# Altium schematic sheet deserializer.SchDoc: SERIALIZER
size 431 x 279 mm; SheetNumber: 3; SheetTotal: 3; SheetRevision: 1.0
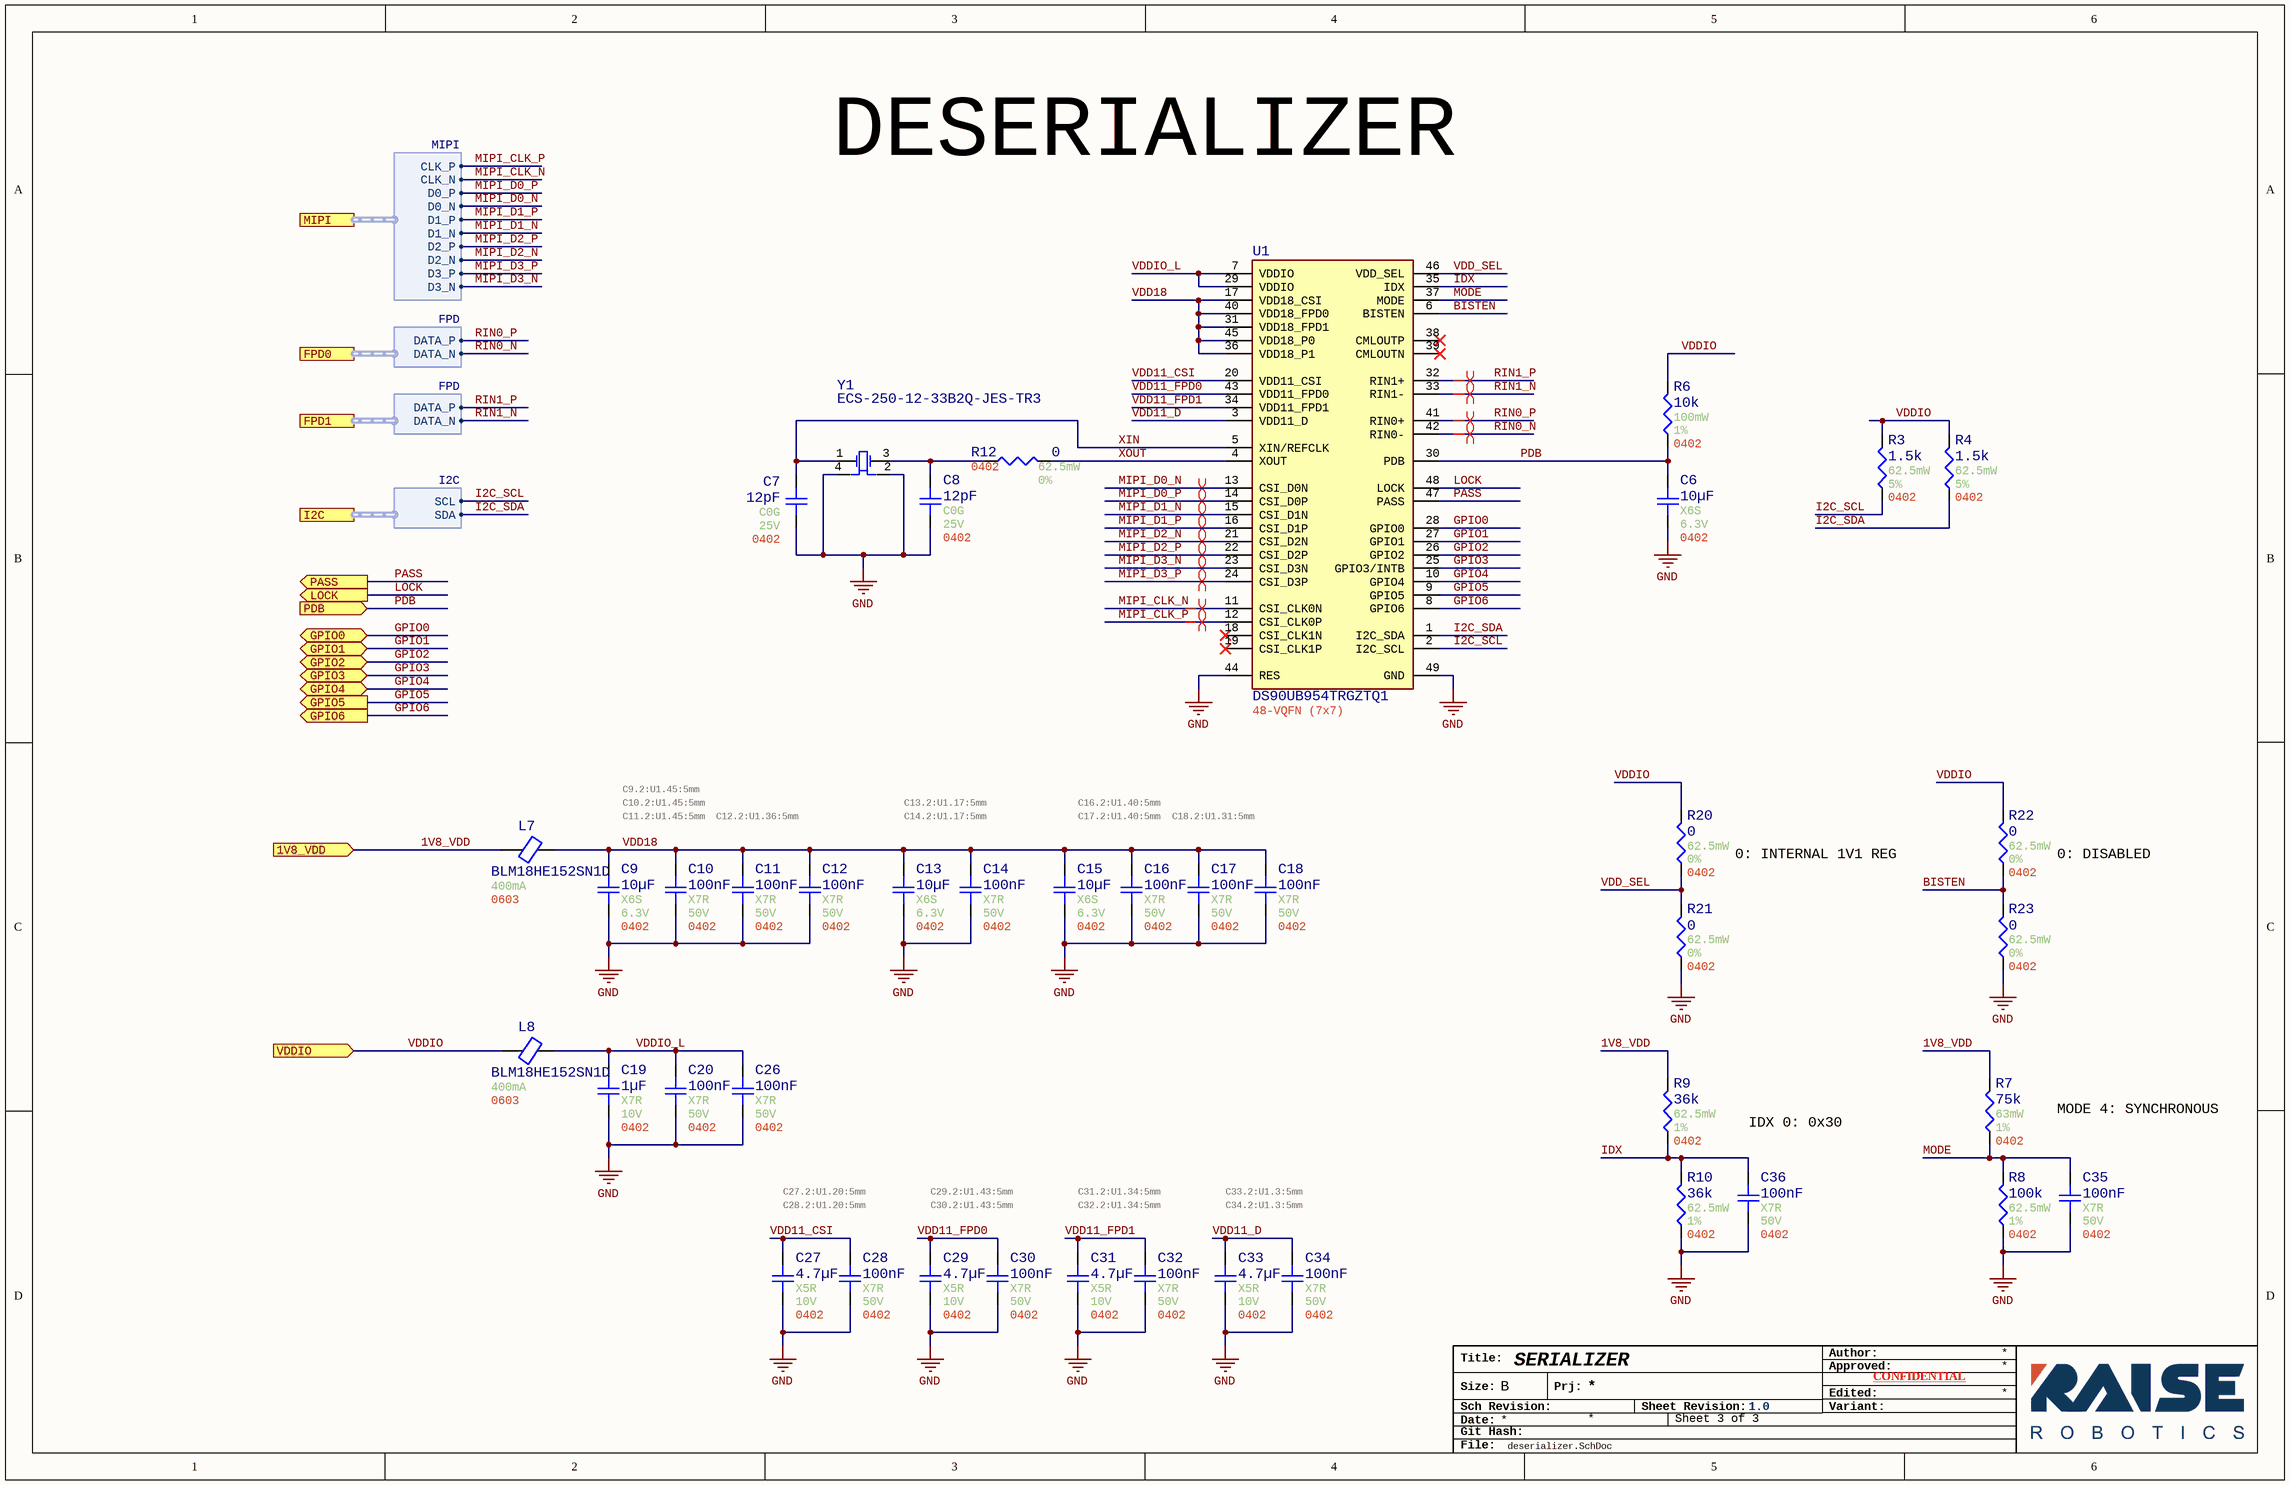
[diagram p0: deserializer.SchDoc]

## Parts
C6  value 10µF  Temperature Coefficient: X6S  Voltage Rating: 6.3V  Case/Package: 0402  [Generic 0402 capacitor]  (hidden comment: GRT155C80J106ME13J)
C7  value 12pF  Temperature Coefficient: C0G  Voltage Rating: 25V  Case/Package: 0402  [Generic 0402 capacitor]  (hidden comment: GRT1555C1E120JA02J)
C8  value 12pF  Temperature Coefficient: C0G  Voltage Rating: 25V  Case/Package: 0402  [Generic 0402 capacitor]  (hidden comment: GRT1555C1E120JA02J)
C9  value 10µF  Temperature Coefficient: X6S  Voltage Rating: 6.3V  Case/Package: 0402  PlaceNear: C9.2:U1.45:5mm  [Generic 0402 capacitor]  (hidden comment: GRT155C80J106ME13J)
C10  value 100nF  Temperature Coefficient: X7R  Voltage Rating: 50V  Case/Package: 0402  PlaceNear: C10.2:U1.45:5mm  [Generic 0402 capacitor]  (hidden comment: GRT155R71H104KE01D)
C11  value 100nF  Temperature Coefficient: X7R  Voltage Rating: 50V  Case/Package: 0402  PlaceNear: C11.2:U1.45:5mm  [Generic 0402 capacitor]  (hidden comment: GRT155R71H104KE01D)
C12  value 100nF  Temperature Coefficient: X7R  Voltage Rating: 50V  Case/Package: 0402  PlaceNear: C12.2:U1.36:5mm  [Generic 0402 capacitor]  (hidden comment: GRT155R71H104KE01D)
C13  value 10µF  Temperature Coefficient: X6S  Voltage Rating: 6.3V  Case/Package: 0402  PlaceNear: C13.2:U1.17:5mm  [Generic 0402 capacitor]  (hidden comment: GRT155C80J106ME13J)
C14  value 100nF  Temperature Coefficient: X7R  Voltage Rating: 50V  Case/Package: 0402  PlaceNear: C14.2:U1.17:5mm  [Generic 0402 capacitor]  (hidden comment: GRT155R71H104KE01D)
C15  value 10µF  Temperature Coefficient: X6S  Voltage Rating: 6.3V  Case/Package: 0402  [Generic 0402 capacitor]  (hidden comment: GRT155C80J106ME13J)
C16  value 100nF  Temperature Coefficient: X7R  Voltage Rating: 50V  Case/Package: 0402  PlaceNear: C16.2:U1.40:5mm  [Generic 0402 capacitor]  (hidden comment: GRT155R71H104KE01D)
C17  value 100nF  Temperature Coefficient: X7R  Voltage Rating: 50V  Case/Package: 0402  PlaceNear: C17.2:U1.40:5mm  [Generic 0402 capacitor]  (hidden comment: GRT155R71H104KE01D)
C18  value 100nF  Temperature Coefficient: X7R  Voltage Rating: 50V  Case/Package: 0402  PlaceNear: C18.2:U1.31:5mm  [Generic 0402 capacitor]  (hidden comment: GRT155R71H104KE01D)
C19  value 1µF  Temperature Coefficient: X7R  Voltage Rating: 10V  Case/Package: 0402  [Generic 0402 capacitor]  (hidden comment: MAASL105CD7105MFCA01)
C20  value 100nF  Temperature Coefficient: X7R  Voltage Rating: 50V  Case/Package: 0402  [Generic 0402 capacitor]  (hidden comment: GRT155R71H104KE01D)
C26  value 100nF  Temperature Coefficient: X7R  Voltage Rating: 50V  Case/Package: 0402  [Generic 0402 capacitor]  (hidden comment: GRT155R71H104KE01D)
C27  value 4.7µF  Temperature Coefficient: X5R  Voltage Rating: 10V  Case/Package: 0402  PlaceNear: C27.2:U1.20:5mm  [Generic 0402 capacitor]  (hidden comment: GRT155R61A475ME13D)
C28  value 100nF  Temperature Coefficient: X7R  Voltage Rating: 50V  Case/Package: 0402  PlaceNear: C28.2:U1.20:5mm  [Generic 0402 capacitor]  (hidden comment: GRT155R71H104KE01D)
C29  value 4.7µF  Temperature Coefficient: X5R  Voltage Rating: 10V  Case/Package: 0402  PlaceNear: C29.2:U1.43:5mm  [Generic 0402 capacitor]  (hidden comment: GRT155R61A475ME13D)
C30  value 100nF  Temperature Coefficient: X7R  Voltage Rating: 50V  Case/Package: 0402  PlaceNear: C30.2:U1.43:5mm  [Generic 0402 capacitor]  (hidden comment: GRT155R71H104KE01D)
C31  value 4.7µF  Temperature Coefficient: X5R  Voltage Rating: 10V  Case/Package: 0402  PlaceNear: C31.2:U1.34:5mm  [Generic 0402 capacitor]  (hidden comment: GRT155R61A475ME13D)
C32  value 100nF  Temperature Coefficient: X7R  Voltage Rating: 50V  Case/Package: 0402  PlaceNear: C32.2:U1.34:5mm  [Generic 0402 capacitor]  (hidden comment: GRT155R71H104KE01D)
C33  value 4.7µF  Temperature Coefficient: X5R  Voltage Rating: 10V  Case/Package: 0402  PlaceNear: C33.2:U1.3:5mm  [Generic 0402 capacitor]  (hidden comment: GRT155R61A475ME13D)
C34  value 100nF  Temperature Coefficient: X7R  Voltage Rating: 50V  Case/Package: 0402  PlaceNear: C34.2:U1.3:5mm  [Generic 0402 capacitor]  (hidden comment: GRT155R71H104KE01D)
C35  value 100nF  Temperature Coefficient: X7R  Voltage Rating: 50V  Case/Package: 0402  [Generic 0402 capacitor]  (hidden comment: GRT155R71H104KE01D)
C36  value 100nF  Temperature Coefficient: X7R  Voltage Rating: 50V  Case/Package: 0402  [Generic 0402 capacitor]  (hidden comment: GRT155R71H104KE01D)
L7  BLM18HE152SN1D  Current Rating: 400mA  Case/Package: 0603  [0603_1.6x0.8x0.8mm_IND]
L8  BLM18HE152SN1D  Current Rating: 400mA  Case/Package: 0603  [0603_1.6x0.8x0.8mm_IND]
R3  value 1.5k  Power: 62.5mW  Tolerance: 5%  Case/Package: 0402  [Generic 0402 Resistor]  (hidden comment: RMCF0402JT1K50)
R4  value 1.5k  Power: 62.5mW  Tolerance: 5%  Case/Package: 0402  [Generic 0402 Resistor]  (hidden comment: RMCF0402JT1K50)
R6  value 10k  Power: 100mW  Tolerance: 1%  Case/Package: 0402  [Generic 0402 Resistor]  (hidden comment: RNCP0402FTD10K0)
R7  value 75k  Power: 63mW  Tolerance: 1%  Case/Package: 0402  [Generic 0402 Resistor]  (hidden comment: WR04X7502FTL)
R8  value 100k  Power: 62.5mW  Tolerance: 1%  Case/Package: 0402  [Generic 0402 Resistor]  (hidden comment: WR04X1003FTL)
R9  value 36k  Power: 62.5mW  Tolerance: 1%  Case/Package: 0402  [Generic 0402 Resistor]  (hidden comment: AC0402FR-0736KL)
R10  value 36k  Power: 62.5mW  Tolerance: 1%  Case/Package: 0402  [Generic 0402 Resistor]  (hidden comment: AC0402FR-0736KL)
R12  value 0  Power: 62.5mW  Tolerance: 0%  Case/Package: 0402  [Generic 0402 Resistor]  (hidden comment: WR04X000PTL)
R20  value 0  Power: 62.5mW  Tolerance: 0%  Case/Package: 0402  [Generic 0402 Resistor]  (hidden comment: WR04X000PTL)
R21  value 0  Power: 62.5mW  Tolerance: 0%  Case/Package: 0402  [Generic 0402 Resistor]  (hidden comment: WR04X000PTL)
R22  value 0  Power: 62.5mW  Tolerance: 0%  Case/Package: 0402  [Generic 0402 Resistor]  (hidden comment: WR04X000PTL)
R23  value 0  Power: 62.5mW  Tolerance: 0%  Case/Package: 0402  [Generic 0402 Resistor]  (hidden comment: WR04X000PTL)
U1  DS90UB954TRGZTQ1  Case/Package: 48-VQFN (7x7)  [VQFN-48_7x7x1.0mm_P0.5mm]
Y1  ECS-250-12-33B2Q-JES-TR3  [ECS-250-12-33B2Q-JES-TR3]

## Ports
1V8_VDD (in), FPD0 (harness FPD), FPD1 (harness FPD), GPIO0 (bidir), GPIO1 (bidir), GPIO2 (bidir), GPIO3 (bidir), GPIO4 (bidir), GPIO5 (out), GPIO6 (out), I2C (harness I2C), LOCK (out), MIPI (harness MIPI), PASS (out), PDB (in), VDDIO (in)

## Harnesses
MIPI: CLK_P, CLK_N, D0_N, D1_P, D1_N, D2_P, D2_N, D3_P, D3_N, D0_P
I2C: SCL, SDA
FPD: DATA_N, DATA_P
FPD: DATA_P, DATA_N

## Nets
GND: C6.1 C7.1 C8.1 C9.1 C10.1 C11.1 C12.1 C13.1 C14.1 C15.1 C16.1 C17.1 C18.1 C19.1 C20.1 C26.1 C27.1 C28.1 C29.1 C30.1 C31.1 C32.1 C33.1 C34.1 C35.1 C36.1 R8.1 R10.1 R21.1 R23.1 U1.44(RES) U1.49(GND) Y1.2 Y1.4
1V8_VDD: L7.1 R7.2 R9.2 ; port 1V8_VDD
BISTEN: R22.1 R23.2 U1.6(BISTEN)
GPIO0: U1.28(GPIO0) ; port GPIO0
GPIO1: U1.27(GPIO1) ; port GPIO1
GPIO2: U1.26(GPIO2) ; port GPIO2
GPIO3: U1.25(GPIO3/INTB) ; port GPIO3
GPIO4: U1.10(GPIO4) ; port GPIO4
GPIO5: U1.9(GPIO5) ; port GPIO5
GPIO6: U1.8(GPIO6) ; port GPIO6
I2C_SCL: R3.1 U1.2(I2C_SCL) ; port I2C.SCL
I2C_SDA: R4.1 U1.1(I2C_SDA) ; port I2C.SDA
IDX: C36.2 R9.1 R10.2 U1.35(IDX)
LOCK: U1.48(LOCK) ; port LOCK
MIPI_CLK_N: U1.11(CSI_CLK0N) ; port MIPI.CLK_N
MIPI_CLK_P: U1.12(CSI_CLK0P) ; port MIPI.CLK_P
MIPI_D0_N: U1.13(CSI_D0N) ; port MIPI.D0_N
MIPI_D0_P: U1.14(CSI_D0P) ; port MIPI.D0_P
MIPI_D1_N: U1.15(CSI_D1N) ; port MIPI.D1_N
MIPI_D1_P: U1.16(CSI_D1P) ; port MIPI.D1_P
MIPI_D2_N: U1.21(CSI_D2N) ; port MIPI.D2_N
MIPI_D2_P: U1.22(CSI_D2P) ; port MIPI.D2_P
MIPI_D3_N: U1.23(CSI_D3N) ; port MIPI.D3_N
MIPI_D3_P: U1.24(CSI_D3P) ; port MIPI.D3_P
MODE: C35.2 R7.1 R8.2 U1.37(MODE)
PASS: U1.47(PASS) ; port PASS
PDB: C6.2 R6.1 U1.30(PDB) ; port PDB
RIN0_N: U1.42(RIN0-) ; port FPD0.DATA_N
RIN0_P: U1.41(RIN0+) ; port FPD0.DATA_P
RIN1_N: U1.33(RIN1-) ; port FPD1.DATA_N
RIN1_P: U1.32(RIN1+) ; port FPD1.DATA_P
VDD11_CSI: C27.2 C28.2 U1.20(VDD11_CSI)
VDD11_D: C33.2 C34.2 U1.3(VDD11_D)
VDD11_FPD0: C29.2 C30.2 U1.43(VDD11_FPD0)
VDD11_FPD1: C31.2 C32.2 U1.34(VDD11_FPD1)
VDD18: C9.2 C10.2 C11.2 C12.2 C13.2 C14.2 C15.2 C16.2 C17.2 C18.2 L7.2 U1.17(VDD18_CSI) U1.31(VDD18_FPD1) U1.36(VDD18_P1) U1.40(VDD18_FPD0) U1.45(VDD18_P0)
VDD_SEL: R20.1 R21.2 U1.46(VDD_SEL)
VDDIO: L8.1 R3.2 R4.2 R6.2 R20.2 R22.2 ; port VDDIO
VDDIO_L: C19.2 C20.2 C26.2 L8.2 U1.7(VDDIO) U1.29(VDDIO)
XIN: C7.2 U1.5(XIN/REFCLK) Y1.1
XOUT: R12.2 U1.4(XOUT)
NetC8_2: C8.2 R12.1 Y1.3

Not connected (* = marked no-connect by the designer): U1 18(CSI_CLK1N)* 19(CSI_CLK1P)* 38(CMLOUTP)* 39(CMLOUTN)*

## Layout directives
differential pair: MIPI_CLK_N, MIPI_CLK_P, MIPI_D0_N, MIPI_D0_P, MIPI_D1_N, MIPI_D1_P, MIPI_D2_N, MIPI_D2_P, MIPI_D3_N, MIPI_D3_P, RIN0_N, RIN0_P, RIN1_N, RIN1_P

## Notes on the sheet
- DESERIALIZER
- 0: INTERNAL 1V1 REG
- 0: DISABLED
- IDX 0: 0x30
- MODE 4: SYNCHRONOUS
- Title:
- Author:
- Approved:
- Size:
- Date:
- Git Hash:
- Sch Revision:
- B
- Prj:
- Sheet Revision:
- Variant:
- Edited:
- CONFIDENTIAL
- File:

## Library data of the parts
C6 C9 C13 C15 = CMP-001-00108-2: Multilayer Ceramic Capacitors MLCC - SMD/SMT 0402 10uF 6.3VDC 20% X6S AEC-Q200; AECQ: Yes; Mounting Technology: Surface Mount; RoHS Compliant: Yes; Pins: 2; Min Operating Temperature: -55°C; Capacitor Type: Ceramic; Tolerance: 20%; Max Operating Temperature: 105°C
C7 C8 = CMP-001-00109-2: Ceramic Capacitor, Multilayer, Ceramic, 25V, 5% +Tol, 5% -Tol, C0G, 30ppm/Cel TC, 0.000012uF, Surface Mount, 0402; AECQ: Yes; Pins: 2; RoHS Compliant: Yes; Max Operating Temperature: 125°C; Mounting Technology: Surface Mount; Capacitor Type: Ceramic; Min Operating Temperature: -55°C; Tolerance: 5%
C10-C12 C14 C16-C18 C20 C26 C28 C30 C32 C34-C36 = CMP-001-00084-12: Ceramic Capacitor, Multilayer, Ceramic, 50V, 10% +Tol, 10% -Tol, X7R, 15% TC, 0.1uF, Surface Mount, 0402; Multilayer: Yes; Terminal Finish: Nickel; Capacitor Type: Ceramic; Package Shape: Rectangular; Reach SVHC Compliant: Yes; Max Operating Temperature: 125°C; RoHS Compliant: Yes; Termination: Wraparound; Packaging: Tape and Reel; AECQ: Yes; Pins: 2; Dielectric Material: Ceramic; Min Operating Temperature: -55°C; Tolerance: 10%; Mounting Technology: Surface Mount
C19 = CMP-001-00104-2: Cap Cer 1UF 20V X7T 0402; AECQ: Yes; Capacitor Type: Ceramic; Tolerance: 20%; Min Operating Temperature: -55°C; Max Operating Temperature: 125°C; Pins: 2; RoHS Compliant: Yes; Mounting Technology: Surface Mount
C27 C29 C31 C33 = CMP-001-00085-5: Ceramic Capacitor, Multilayer, Ceramic, 10V, 20% +Tol, 20% -Tol, X5R, 15% TC, 4.7uF, Surface Mount, 0402; Multilayer: Yes; Tolerance: 0%; Reach SVHC Compliant: Yes; Tolerance (fill in as +-): 20%; Packaging: Tape and Reel; Dielectric Material: Ceramic; Mounting Technology: Surface Mount; RoHS Compliant: Yes; Tolerance  (fill in as +-): 20%; Rated DC Voltage (URdc): 10V; Package Shape: Rectangular; Termination: Wraparound; Pins: 2; Max Operating Temperature: 85°C; Capacitor Type: Ceramic; Min Operating Temperature: -55°C; AECQ: Yes
L7 L8 = CMP-006-00026-1: Ferrite Beads Multi-Layer 1.5KOhm 25% 100MHz 500mA 500mOhm DCR 0603 T/R; Current - Saturation: 13.3A; AECQ: no; DCR: 20.5m; Shileded: Yes; Height: 800µm; Max Operating Temperature: 125°C; Pins: 2; Tolerance: 25%; Min Operating Temperature: -55°C
R3 R4 = CMP-009-00226-1: Res Thick Film 0402 1.5K Ohm 5% 0.063W ±100ppm/°C Molded SMD Paper T/R; AECQ: Yes; Pins: 2; Mounting Technology: Surface Mount; RoHS Compliant: Yes; Max Operating Temperature: 155°C; Min Operating Temperature: -55°C
R6 = CMP-009-00242-1: Fixed Resistor, Thin Film, 0.1W, 10000ohm, 50V, 1% +/-Tol, 100ppm/Cel, Surface Mount, 0402; Manufacturer Part Number: Blank; AECQ: Yes; Pins: 2; Max Operating Temperature: 155°C; Voltage Rating: 50V; Mounting Technology: SMD; Min Operating Temperature: -55°C
R7 = CMP-009-00227-1: Res Thick Film 0402 75K Ohm 1% 0.063W(1/16W) ±100ppm/C Pad SMD T/R; AECQ: Yes; Max Operating Temperature: 155°C; Min Operating Temperature: -55°C; Pins: 2; Mounting Technology: SMD
R8 = CMP-009-00188-7: Fixed Resistor, Metal Glaze/thick Film, 0.0625W, 100000ohm, 50V, 1% +/-Tol, 100ppm/Cel, Surface Mount, 0402; Manufacturer Part Number: Blank; Package Height: 0.35mm; AECQ: No; Temperature Coefficient (ppm/Cel): 100; Package Length: 1mm; Package Width: 0.5mm; Additional Feature: LASER TRIMMABLE; Rated Temperature: 70°C; Construction: Chip; RoHS Compliant: Yes; Resistor Type: FIXED RESISTOR; Min Operating Temperature: -55°C; Pins: 2; Technology: METAL GLAZE/THICK FILM; Reach SVHC Compliant: Yes; Working Voltage: 50V; JESD-609 Code: e3; Mounting Technology: Surface Mount; Max Operating Temperature: 155°C; Termination: Wraparound; Terminal Finish: Nickel; Packaging: Tape and Reel; Package Shape: Rectangular
R9 R10 = CMP-009-00198-3: Fixed Resistor, Metal Glaze/thick Film, 0.0625W, 36000ohm, 50V, 1% +/-Tol, 100ppm/Cel, Surface Mount, 0402; AECQ: Yes; Pins: 2; Mounting Technology: SMD; Min Operating Temperature: -55°C; Max Operating Temperature: 155°C
R12 R20-R23 = CMP-009-00186-8: Fixed Resistor, Metal Glaze/thick Film, 0.0625W, 0ohm, Surface Mount, 0402; Manufacturer Part Number: Blank; AECQ: No; Package Length: 1mm; Rated Temperature: 70°C; Package Height: 0.35mm; Package Width: 0.5mm; Resistor Type: FIXED RESISTOR; RoHS Compliant: Yes; Package Shape: Rectangular; Construction: Chip; Terminal Finish: Nickel; JESD-609 Code: e3; Pins: 2; Mounting Technology: Surface Mount; Technology: METAL GLAZE/THICK FILM; Termination: Wraparound; Reach SVHC Compliant: Yes; Min Operating Temperature: -55°C; Max Operating Temperature: 155°C; Packaging: Tape and Reel
U1 = CMP-010-00050-1: Dual 2 MP FPD-Link III deserializer with CSI-2 outputs for 2MP/60fps cameras & radar 48-VQFN -40 to 105; Nominal Supply Voltage: 5.7V; Nominal Supply Current: 370µA; Min Supply Voltage: 1.71V; Sensor Type: Current shunt amp; Output Current: 6A; Max Supply Voltage: 3.6V; Mounting Technology: SMD; Pins: 48; Max Operating Temperature: 105°C; Min Operating Temperature: -40°C
Y1 = CMP-003-00030-1: Crystal 25.000 Mhz 12PF SMD; AECQ: Yes; ESR: 50; Frequency: 25MHz; Mounting Technology: SMD; Min Operating Temperature: -40°C; Case/Package: 3.2x2.5; Load Capacitance: 12pF; Pins: 4; Max Operating Temperature: 125°C